# Altium project NC1-1BA.PrjPcb (part 1 of 2)
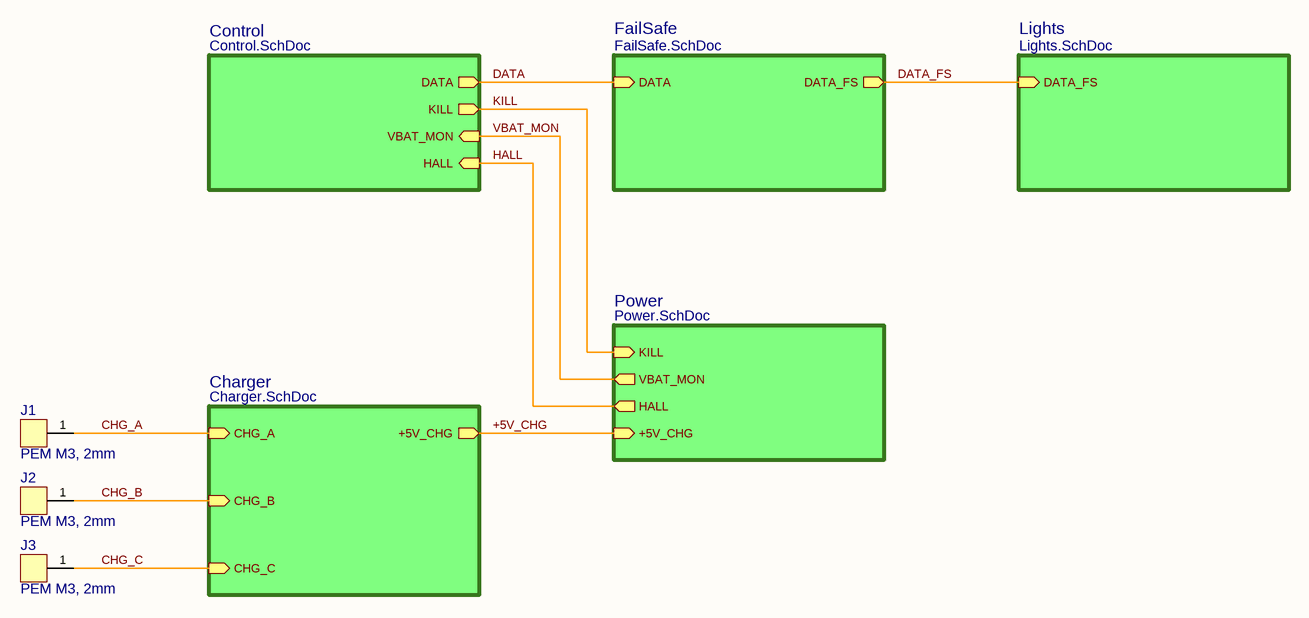
[diagram p0: NC1-1-Top.SchDoc]
Author: ahorat / daniw; Index_Main: B; Index_Sub: A; Layout_Designer: daniw; PCB_NAME: NC1-1; Project: NightCone; Schema_Designer: ahorat / daniw
7 sheets, 278 parts. Net scope: hierarchical (ports join the sheet entries above them; power ports are global).
Board files: NC1-1B-BASIS.PcbDoc, NC1-1B-PANEL_Single.PcbDoc
Sheets:
  NC1-1-Top.SchDoc
    Control = Control.SchDoc
    FailSafe = FailSafe.SchDoc
    Lights = Lights.SchDoc
      LED0 = LED.SchDoc
      LED1 = LED.SchDoc
      LED2 = LED.SchDoc
      LED3 = LED.SchDoc
      LED4 = LED.SchDoc
      LED5 = LED.SchDoc
      LED6 = LED.SchDoc
      LED7 = LED.SchDoc
      LED8 = LED.SchDoc
      LED9 = LED.SchDoc
      LED10 = LED.SchDoc
      LED11 = LED.SchDoc
      LED12 = LED.SchDoc
      LED13 = LED.SchDoc
      LED14 = LED.SchDoc
      LED15 = LED.SchDoc
      LED16 = LED.SchDoc
      LED17 = LED.SchDoc
      LED18 = LED.SchDoc
    Charger = Charger.SchDoc
    Power = Power.SchDoc

## Sheet NC1-1-Top.SchDoc: Top
size A3; SheetNumber: 1; SheetTotal: 7

### Parts
J1  PEM M3, 2mm  [MECH_SMTSO3020CTJ]
J2  PEM M3, 2mm  [MECH_SMTSO3020CTJ]
J3  PEM M3, 2mm  [MECH_SMTSO3020CTJ]

### Sub-sheets
Charger = Charger.SchDoc: +5V_CHG (out), CHG_A (in), CHG_B (in), CHG_C (in)
Control = Control.SchDoc: DATA (out), KILL (out), VBAT_MON (in), HALL (in)
FailSafe = FailSafe.SchDoc: DATA_FS (out), DATA (in)
Lights = Lights.SchDoc: DATA_FS (in)
Power = Power.SchDoc: KILL (in), +5V_CHG (in), VBAT_MON (out), HALL (out)

### Nets
+5V_CHG: sheet Charger/+5V_CHG, sheet Power/+5V_CHG
CHG_A: J1.1 ; sheet Charger/CHG_A
CHG_B: J2.1 ; sheet Charger/CHG_B
CHG_C: J3.1 ; sheet Charger/CHG_C
DATA: sheet Control/DATA, sheet FailSafe/DATA
DATA_FS: sheet FailSafe/DATA_FS, sheet Lights/DATA_FS
HALL: sheet Control/HALL, sheet Power/HALL
KILL: sheet Control/KILL, sheet Power/KILL
VBAT_MON: sheet Control/VBAT_MON, sheet Power/VBAT_MON

### Notes on the sheet
- Date:
- Size:
- A3
- Schema:
- Layout:

### Library data of the parts
J1-J3 = PEM M3, 2mm: Solder Nut M3x0.5, 2mm; Manufacturer: GENERIC; Part Number: PEM M3, 2mm; Manufacturer 2: PEM; Manufacturer Part Number 2: SMTSO-M3-2ET; Supplier 2: Mouser; Supplier Part Number 2: 153-SMTSO-M3-2ET; Manufacturer 3: Sinhoo; Manufacturer Part Number 3: SMTSO3020MTJ; Supplier 3: LCSC; Supplier Part Number 3: C2915633; JLC Type: Extended

## Sheet Control.SchDoc: Control Module
size A3; SheetNumber: 2; SheetTotal: 7
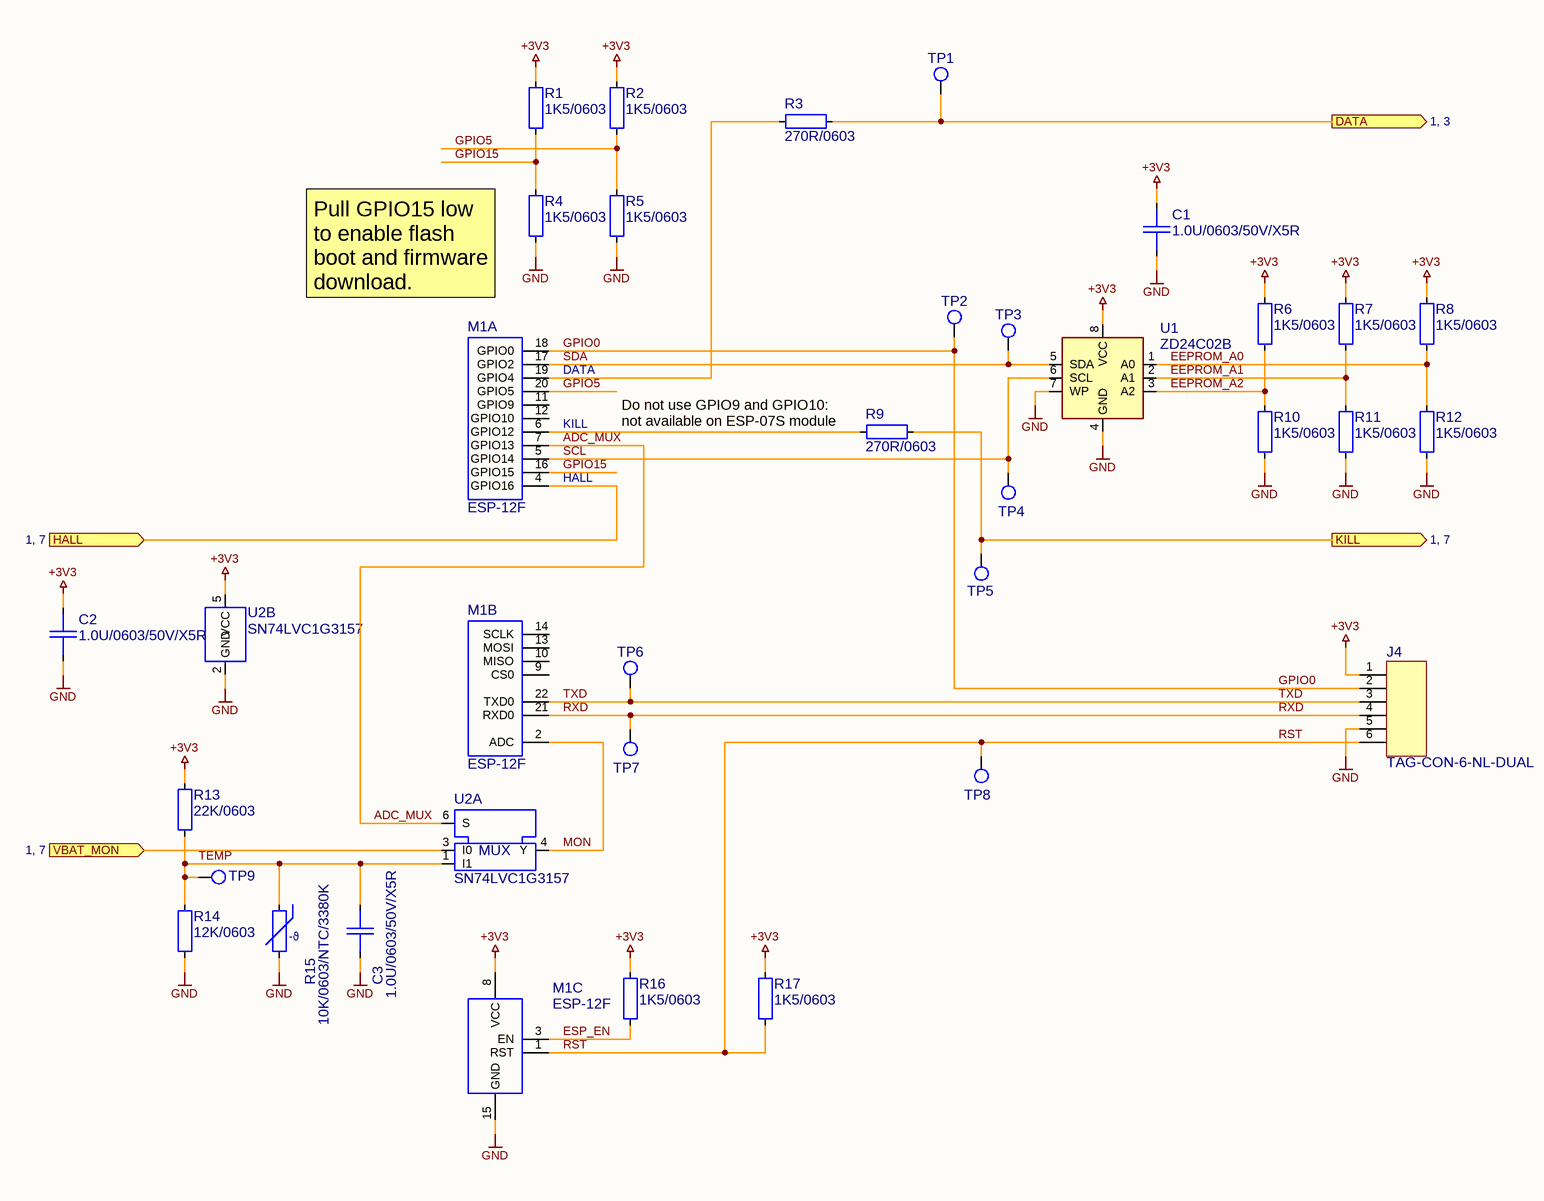
[diagram p1: Control.SchDoc]

### Parts
C1  1.0U/0603/50V/X5R  [CAP0603_X7R]
C2  1.0U/0603/50V/X5R  [CAP0603_X7R]
C3  1.0U/0603/50V/X5R  [CAP0603_X7R]
J4  TAG-CON-6-NL-DUAL  [TC2030-NL-2]
M1  ESP-12F  [ESP-12F]  (parts A,B,C of 3)
R1  1K5/0603  [R0603-0.40-WW]
R2  1K5/0603  [R0603-0.40-WW]
R3  270R/0603  [R0603-0.40-WW]
R4  1K5/0603  [R0603-0.40-WW]
R5  1K5/0603  [R0603-0.40-WW]
R6  1K5/0603  [R0603-0.40-WW]
R7  1K5/0603  [R0603-0.40-WW]
R8  1K5/0603  [R0603-0.40-WW]
R9  270R/0603  [R0603-0.40-WW]
R10  1K5/0603  [R0603-0.40-WW]
R11  1K5/0603  [R0603-0.40-WW]
R12  1K5/0603  [R0603-0.40-WW]
R13  22K/0603  [R0603-0.40-WW]
R14  12K/0603  [R0603-0.40-WW]
R15  10K/0603/NTC/3380K  [R0603-0.40-WW]
R16  1K5/0603  [R0603-0.40-WW]
R17  1K5/0603  [R0603-0.40-WW]
TP1  TP_THD_1.5/0.8  [TP_THD_1.5/0.8]  (value not drawn)  (no BOM)
TP2  TP_THD_1.5/0.8  [TP_THD_1.5/0.8]  (value not drawn)  (no BOM)
TP3  TP_THD_1.5/0.8  [TP_THD_1.5/0.8]  (value not drawn)  (no BOM)
TP4  TP_THD_1.5/0.8  [TP_THD_1.5/0.8]  (value not drawn)  (no BOM)
TP5  TP_THD_1.5/0.8  [TP_THD_1.5/0.8]  (value not drawn)  (no BOM)
TP6  TP_THD_1.5/0.8  [TP_THD_1.5/0.8]  (value not drawn)  (no BOM)
TP7  TP_THD_1.5/0.8  [TP_THD_1.5/0.8]  (value not drawn)  (no BOM)
TP8  TP_THD_1.5/0.8  [TP_THD_1.5/0.8]  (value not drawn)  (no BOM)
TP9  TP_THD_1.5/0.8  [TP_THD_1.5/0.8]  (value not drawn)  (no BOM)
U1  ZD24C02B  [SOP127P600X155-8-SW]
U2  SN74LVC1G3157  [SOT65P210X95-6-SE]  (parts A,B of 2)

### Ports
DATA (out, see 1, 3), HALL (in, see 1, 7), KILL (out, see 1, 7), VBAT_MON (in, see 1, 7)

### Nets
+3V3: C1.1 C2.1 J4.1 M1.8(VCC) R1.1 R2.1 R6.1 R7.1 R8.1 R13.1 R16.1 R17.1 U1.8(VCC) U2.5(VCC)
GND: C1.2 C2.2 C3.2 J4.5 M1.15(GND) R4.2 R5.2 R10.2 R11.2 R12.2 R14.2 R15.2 U1.4(GND) U1.7(WP) U2.2(GND)
ADC_MUX: M1.7(GPIO13) U2.6(S)
DATA: R3.2 TP1.1 ; port DATA
EEPROM_A0: R8.2 R12.1 U1.1(A0)
EEPROM_A1: R7.2 R11.1 U1.2(A1)
EEPROM_A2: R6.2 R10.1 U1.3(A2)
ESP_EN: M1.3(EN) R16.2
GPIO0: J4.2 M1.18(GPIO0) TP2.1
GPIO5: M1.20(GPIO5) R2.2 R5.1
GPIO15: M1.16(GPIO15) R1.2 R4.1
HALL: M1.4(GPIO16) ; port HALL
KILL: R9.2 TP5.1 ; port KILL
MON: M1.2(ADC) U2.4(Y)
RST: J4.6 M1.1(RST) R17.2 TP8.1
RXD: J4.4 M1.21(RXD0) TP7.1
SCL: M1.5(GPIO14) TP4.1 U1.6(SCL)
SDA: M1.17(GPIO2) TP3.1 U1.5(SDA)
TEMP: C3.1 R13.2 R14.1 R15.1 TP9.1 U2.1(I1)
TXD: J4.3 M1.22(TXD0) TP6.1
VBAT_MON: U2.3(I0) ; port VBAT_MON
NetM1_6: M1.6(GPIO12) R9.1
NetM1_19: M1.19(GPIO4) R3.1

Not connected (* = marked no-connect by the designer): M1 9(CS0) 10(MISO) 11(GPIO9) 12(GPIO10) 13(MOSI) 14(SCLK)

### Notes on the sheet
- Pull GPIO15 low to enable flash boot and firmware download.
- (near M1) DATA
- (near M1) KILL
- (near M1) HALL
- (near R9) Do not use GPIO9 and GPIO10:
  not available on ESP-07S module
- Date:
- Size:
- A3
- Schema:
- Layout:
- (in symbol 10K/0603/NTC/3380K) -ϑ
- (in symbol SN74LVC1G3157, part A) MUX

### Library data of the parts
C1-C3 = 1.0U/0603/50V/X5R: CAP SM 0603 1.0uF 50V X5R; Manufacturer: GENERIC; Manufacturer 1: Samsung Electro-Mechanics; Manufacturer Part Number 1: CL10A105KB8NNNC; Absolute Value: 1E-6; Eurocircuits GPN: GPC0603105-X5R; Part Number: 1.0U/0603/50V/X5R; Package: 0603; Value: 1.0uF; Manufacturer Part Number 3: CL10A105KB8NNNC; Supplier 3: LCSC; Supplier Part Number 3: C15849; JLC Type: Basic; HelpURL: https://mm.digikey.com/Volume0/opasdata/d220001/medias/docus/658/CL10A105KB8NNNC_Spec.pdf; Supplier 1: Digi-Key; Supplier Part Number 1: 1276-1860-1-ND
J4 = TAG-CON-6-NL-DUAL: Tag-Connect 2030-NL, 6 pins, no legs, two-sided; Part Number: TAG-CON-6-NL-DUAL; Manufacturer: TAG-CONNECT; HelpURL: https://www.tag-connect.com/wp-content/uploads/bsk-pdf-manager/2022/06/TC2030-MCP-NL.pdf
M1 = ESP-12F: ESP8266 based Module with 4MByte Storage; Manufacturer: AI-Thinker; Part Number: ESP-12F; Package: Board; Manufacturer 3: Ai-Thinker; Manufacturer Part Number 3: ESP-12F(ESP8266MOD); Supplier 3: LCSC; Supplier Part Number 3: C82891; JLC Type: Extended
R1 R2 R4-R8 R10-R12 R16 R17 = 1K5/0603: RES SM 0603 1K5; Manufacturer: GENERIC; Manufacturer 1: YAGEO; Manufacturer Part Number 1: RC0603FR-131K5L; Absolute Value: 1500; Part Number: 1K5/0603; Package: 0603; Value: 1K5; HelpURL: https://www.yageo.com/upload/media/product/app/datasheet/rchip/pyu-rc_group_51_rohs_l.pdf; Supplier 1: Digi-Key; Supplier Part Number 1: 13-RC0603FR-131K5LCT-ND; Manufacturer 2: YAGEO; Manufacturer Part Number 2: RC0603FR-101K5L; Supplier 2: Digi-Key; Supplier Part Number 2: 13-RC0603FR-101K5LCT-ND; Manufacturer 3: UNI-ROYAL(Uniroyal Elec); Manufacturer Part Number 3: 0603WAF1501T5E; Supplier 3: LCSC; Supplier Part Number 3: C22843; JLC Type: Basic
R3 R9 = 270R/0603: RES SM 0603 270R; Manufacturer: GENERIC; Manufacturer 1: YAGEO; Manufacturer Part Number 1: RC0603FR-13270RL; Absolute Value: 270; Eurocircuits GPN: GPR0603270R; Part Number: 270R/0603; Package: 0603; Value: 270R; HelpURL: https://www.yageo.com/upload/media/product/productsearch/datasheet/rchip/PYu-RC_Group_51_RoHS_L_12.pdf; Supplier 1: Digi-Key; Supplier Part Number 1: 13-RC0603FR-13270RLCT-ND; Manufacturer 2: YAGEO; Manufacturer Part Number 2: RC0603FR-10270RL; Supplier 2: Digi-Key; Supplier Part Number 2: 13-RC0603FR-10270RLCT-ND; Manufacturer 3: UNI-ROYAL(Uniroyal Elec); Manufacturer Part Number 3: 0603WAF2700T5E; Supplier 3: LCSC; Supplier Part Number 3: C22966; JLC Type: Basic
R13 = 22K/0603: RES SM 0603 22K; Manufacturer: GENERIC; Manufacturer 1: YAGEO; Manufacturer Part Number 1: RC0603FR-1322KL; Absolute Value: 22000; Eurocircuits GPN: GPR060322K; Part Number: 22K/0603; Package: 0603; Value: 22K; HelpURL: https://www.yageo.com/upload/media/product/app/datasheet/rchip/pyu-rc_group_51_rohs_l.pdf; Supplier 1: Digi-Key; Supplier Part Number 1: 13-RC0603FR-1322KLCT-ND; Manufacturer 2: YAGEO; Manufacturer Part Number 2: RC0603FR-1022KL; Supplier 2: Digi-Key; Supplier Part Number 2: 13-RC0603FR-1022KLCT-ND; Manufacturer 3: UNI-ROYAL(Uniroyal Elec); Manufacturer Part Number 3: 0603WAF2202T5E; Supplier 3: LCSC; Supplier Part Number 3: C31850; JLC Type: Basic
R14 = 12K/0603: RES SM 0603 12K; Manufacturer: GENERIC; Manufacturer 1: YAGEO; Manufacturer Part Number 1: RC0603FR-1312KL; Absolute Value: 12000; Eurocircuits GPN: GPR060312K; Part Number: 12K/0603; Package: 0603; Value: 12K; HelpURL: https://www.yageo.com/upload/media/product/app/datasheet/rchip/pyu-rc_group_51_rohs_l.pdf; Supplier 1: Digi-Key; Supplier Part Number 1: 13-RC0603FR-1312KLCT-ND; Manufacturer 2: YAGEO; Manufacturer Part Number 2: RC0603FR-1012KL; Supplier 2: Digi-Key; Supplier Part Number 2: 13-RC0603FR-1012KLCT-ND
R15 = 10K/0603/NTC/3380K: RES NTC SM 0603 10K; Manufacturer: GENERIC; Manufacturer 1: Murata; Manufacturer Part Number 1: NCU18XH103E60RB; Absolute Value: 10000; Part Number: 10K/0603/NTC/3380K; Package: 603; Value: 10K; HelpURL: https://www.murata.com/en-us/api/pdfdownloadapi?cate=luNTCforTempeSenso&partno=NCU18XH103E60RB; Supplier 1: Digi-Key; Supplier Part Number 1: 490-18164-1-ND; Manufacturer 3: Sunlord; Manufacturer Part Number 3: SDNT1608X103F3380FTF; Supplier 3: LCSC; Supplier Part Number 3: C316397; JLC Type: Extended
TP1-TP9 = TP_THD_1.5/0.8: THT Test Point 1.5/0.8mm; Manufacturer: NONE; Part Number: TP_THD_1.5/0.8
U1 = ZD24C02B: I2C-Compatible (2-wire) Serial EEPROM 2K bits; Manufacturer: Zetta; Part Number: ZD24C02B; Package: SOIC-8; HelpURL: https://datasheet.lcsc.com/lcsc/2402020955_Zetta-ZD24C02B-SSGMB_C5374786.pdf; Manufacturer 3: Zetta; Manufacturer Part Number 3: ZD24C02B-SSGMB; Supplier 3: LCSC; Supplier Part Number 3: C5374786; JLC Type: Extended
U2 = SN74LVC1G3157: Single-Pole-Double-Throw Analog Switch; Manufacturer: TI; Part Number: SN74LVC1G3157; Package: SOT-363-6; Manufacturer 3: Texas Instruments; Manufacturer Part Number 3: SN74LVC1G3157DCKR; Supplier 3: LCSC; Supplier Part Number 3: C38663

## Sheet FailSafe.SchDoc: FailSafe
size A3; SheetNumber: 3; SheetTotal: 7
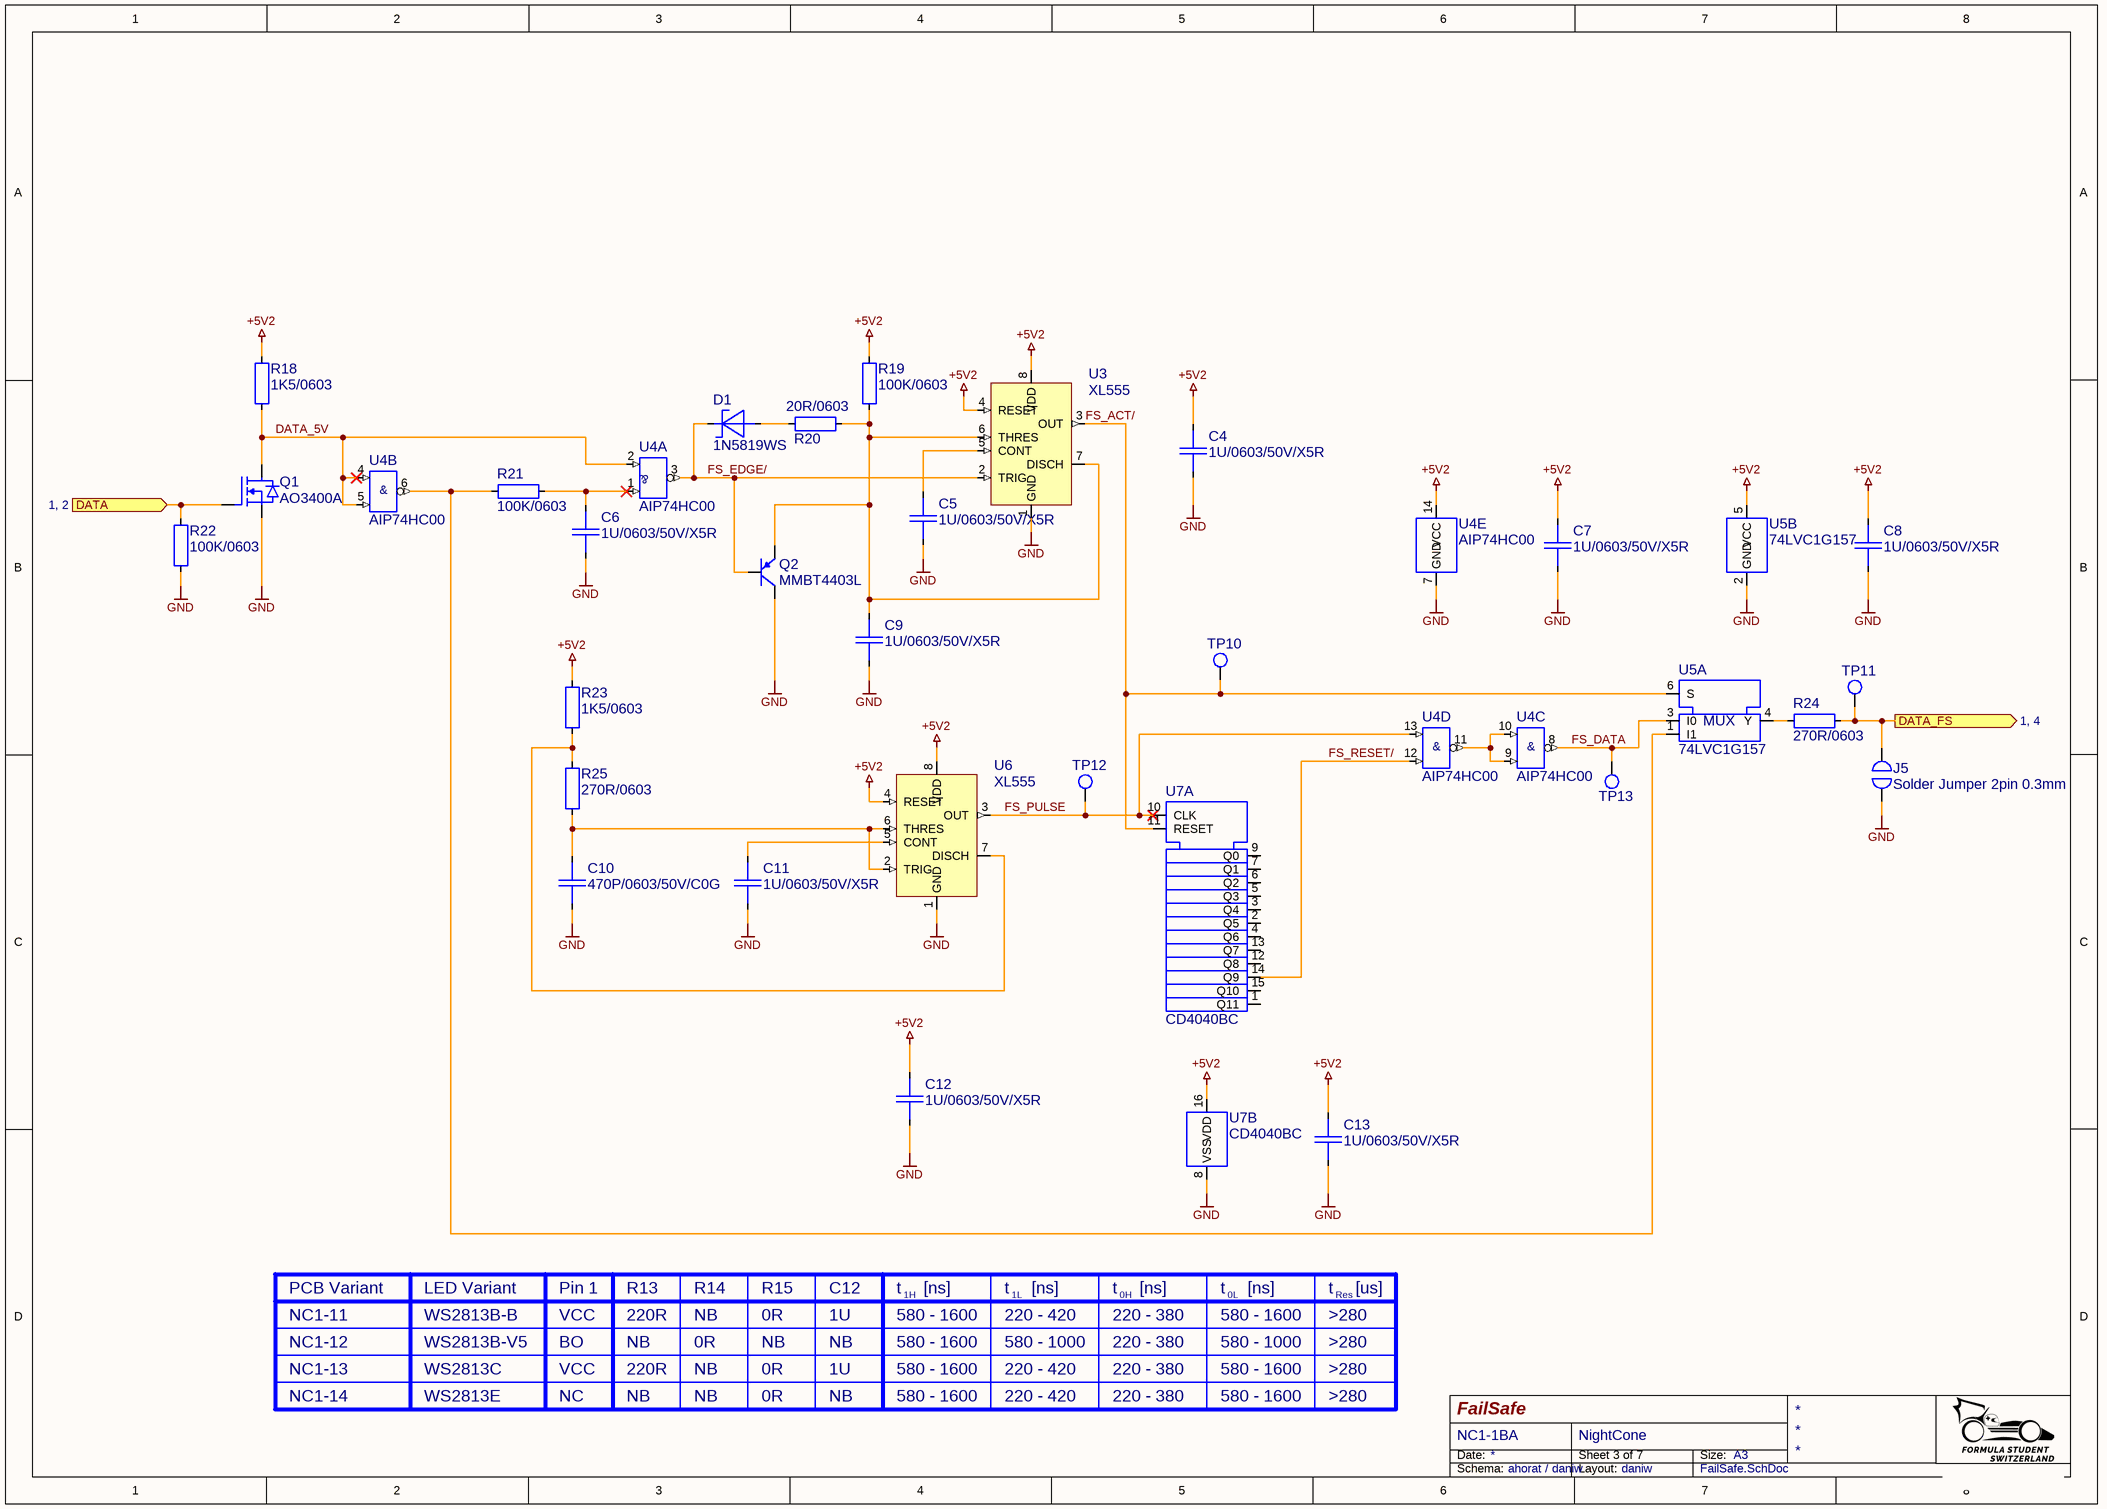
[diagram p2: FailSafe.SchDoc]

### Parts
C4  1U/0603/50V/X5R  [CAP0603_X7R]
C5  1U/0603/50V/X5R  [CAP0603_X7R]
C6  1U/0603/50V/X5R  [CAP0603_X7R]
C7  1U/0603/50V/X5R  [CAP0603_X7R]
C8  1U/0603/50V/X5R  [CAP0603_X7R]
C9  1U/0603/50V/X5R  [CAP0603_X7R]
C10  470P/0603/50V/C0G  [CAP0603_C0G]
C11  1U/0603/50V/X5R  [CAP0603_X7R]
C12  1U/0603/50V/X5R  [CAP0603_X7R]
C13  1U/0603/50V/X5R  [CAP0603_X7R]
D1  1N5819WS  [SOD2513X100]
J5  Solder Jumper 2pin 0.3mm  [Solder_Jumper_2pin_0.3mm]
Q1  AO3400A  [SOT2395P280X125-3-SE]
Q2  MMBT4403L  [SOT2395P280X125-3-SE]
R18  1K5/0603  [R0603-0.40-WW]
R19  100K/0603  [R0603-0.40-WW]
R20  20R/0603  [R0603-0.40-WW]
R21  100K/0603  [R0603-0.40-WW]
R22  100K/0603  [R0603-0.40-WW]
R23  1K5/0603  [R0603-0.40-WW]
R24  270R/0603  [R0603-0.40-WW]
R25  270R/0603  [R0603-0.40-WW]
TP10  TP_THD_1.5/0.8  [TP_THD_1.5/0.8]  (value not drawn)  (no BOM)
TP11  TP_THD_1.5/0.8  [TP_THD_1.5/0.8]  (value not drawn)  (no BOM)
TP12  TP_THD_1.5/0.8  [TP_THD_1.5/0.8]  (value not drawn)  (no BOM)
TP13  TP_THD_1.5/0.8  [TP_THD_1.5/0.8]  (value not drawn)  (no BOM)
U3  XL555  [SOP127P600X155-8-SW]
U4  AIP74HC00  [SOP127P600X155-14-SW]  (parts A,B,C,D,E of 5)
U5  74LVC1G157  [SOT65P210X95-6-SE]  (parts A,B of 2)
U6  XL555  [SOP127P600X155-8-SW]
U7  CD4040BC  [SOP127P600X155-16-SW]  (parts A,B of 2)

### Ports
DATA (in, see 1, 2), DATA_FS (out, see 1, 4)

### Nets
+5V2: C4.1 C7.1 C8.1 C12.1 C13.1 R18.1 R19.1 R23.1 U3.4(RESET) U3.8(VDD) U4.14(VCC) U5.5(VCC) U6.4(RESET) U6.8(VDD) U7.16(VDD)
GND: C4.2 C5.2 C6.2 C7.2 C8.2 C9.2 C10.2 C11.2 C12.2 C13.2 J5.2 Q1.2(SOURCE) Q2.3(COLLECTOR) R22.1 U3.1(GND) U4.7(GND) U5.2(GND) U6.1(GND) U7.8(VSS)
DATA: Q1.1(GATE) R22.2 ; port DATA
DATA_5V: Q1.3(DRAIN) R18.2 U4.2(B0) U4.4(A1) U4.5(B1)
DATA_FS: J5.1 R24.2 TP11.1 ; port DATA_FS
FS_ACT/: TP10.1 U3.3(OUT) U5.6(S) U7.11(RESET)
FS_DATA: TP13.1 U4.8(Y2) U5.3(I0)
FS_EDGE/: D1.1 Q2.1(BASE) U3.2(TRIG) U4.3(Y0)
FS_PULSE: TP12.1 U4.13(A3) U6.3(OUT) U7.10(CLK)
FS_RESET/: U4.12(B3) U7.14(Q9)
NetC5_1: C5.1 U3.5(CONT)
NetC6_1: C6.1 R21.2 U4.1(A0)
NetC9_1: C9.1 Q2.2(EMITTER) R19.2 R20.2 U3.6(THRES) U3.7(DISCH)
NetC10_1: C10.1 R25.2 U6.2(TRIG) U6.6(THRES)
NetC11_1: C11.1 U6.5(CONT)
NetD1_2: D1.2 R20.1
NetR21_1: R21.1 U4.6(Y1) U5.1(I1)
NetR23_2: R23.2 R25.1 U6.7(DISCH)
NetR24_1: R24.1 U5.4(Y)
NetU4_9: U4.9(B2) U4.10(A2) U4.11(Y3)

Not connected (* = marked no-connect by the designer): U7 1(Q11) 2(Q5) 3(Q4) 4(Q6) 5(Q3) 6(Q2) 7(Q1) 9(Q0) 12(Q8) 13(Q7) 15(Q10)

### Notes on the sheet
- PCB Variant
- NC1-11
- LED Variant
- WS2813B-B
- Pin 1
- VCC
- R13
- 220R
- R14
- NB
- R15
- 0R
- C12
- 1U
- t
- 580 - 1600
- 1H
- [ns]
- 220 - 420
- 1L
- 220 - 380
- 0H
- 0L
- >280
- Res
- [us]
- NC1-12
- NC1-13
- NC1-14
- WS2813B-V5
- WS2813C
- WS2813E
- BO
- NC
- 580 - 1000
- Date:
- Size:
- A3
- Schema:
- Layout:
- (in symbol 74LVC1G157, part A) MUX
- (in symbol AIP74HC00, part A) &
- (in symbol AIP74HC00, part B) &
- (in symbol AIP74HC00, part C) &
- (in symbol AIP74HC00, part D) &

### Library data of the parts
C4-C9 C11-C13 = 1U/0603/50V/X5R: CAP SM 0603 1.0uF 50V X5R; Manufacturer: GENERIC; Absolute Value: 1E-6; Part Number: 1U/0603/50V/X5R; Package: 603; Value: 1.0uF; Manufacturer Part Number 3: CL10A105KB8NNNC; Supplier 3: LCSC; Supplier Part Number 3: C15849; JLC Type: Basic
C10 = 470P/0603/50V/C0G: CAP SM 0603 470pF 50V C0G; Manufacturer: GENERIC; Manufacturer 1: YAGEO; Manufacturer Part Number 1: CC0603JRNPO9BN471; Absolute Value: 4.7E-10; Part Number: 470P/0603/50V/C0G; Package: 603; Value: 470pF; HelpURL: https://www.yageo.com/upload/media/product/productsearch/datasheet/mlcc/UPY-GP_NP0_16V-to-50V_18.pdf; Supplier 1: Digi-Key; Supplier Part Number 1: 311-1520-1-ND; Manufacturer 2: YAGEO; Manufacturer Part Number 2: CC0603KRNPO9BN471; Supplier 2: Digi-Key; Supplier Part Number 2: 311-4038-1-ND; Manufacturer Part Number 3: GCM1885C1H471JA16D; Supplier 3: LCSC; Supplier Part Number 3: C126566; JLC Type: Extended
D1 = 1N5819WS: 40V 600mV@1A 1A SOD-323 Schottky Barrier Diodes (SBD) ROHS; Manufacturer: GENERIC; Part Number: 1N5819WS; Package: SOD323; Value: 1N5819WS; Absolute Value: 40V; HelpURL: https://datasheet.lcsc.com/lcsc/2204281430_Guangdong-Hottech-1N5819WS_C191023.pdf; Manufacturer 3: Guangdong Hottech; Manufacturer Part Number 3: 1N5819WS; Supplier 3: LCSC; Supplier Part Number 3: C191023; JLC Type: Basic
J5 = Solder_Jumper_2pin_0.3mm: Solder jumper with two pins with a spacing of 0.3mm; Manufacturer: NONE; Part Number: Solder_Jumper_2pin_0.3mm
Q1 = AO3400A: 30V N-Channel MOSFET; Manufacturer: Alpha & Omega Semiconductor; Part Number: AO3400A; Package: SOT23; HelpURL: https://aosmd.com/res/data_sheets/AO3400A.pdf; Manufacturer 3: Alpha & Omega Semiconductor; Manufacturer Part Number 3: AO3400A; Supplier 3: LCSC; Supplier Part Number 3: C20917; JLC Type: Basic
Q2 = MMBT4403L: Switching Transistor PNP Silicon; Manufacturer: ON SEMI; Part Number: MMBT4403L; Package: SOT23; HelpURL: https://www.onsemi.com/pdf/datasheet/mmbt4403lt1-d.pdf; Manufacturer 3: ONSEMI; Manufacturer Part Number 3: MMBT4403LT1G; Supplier 3: LCSC; Supplier Part Number 3: C78864; JLC Type: Extended
R18 R23 = 1K5/0603: as R1 on sheet Control; Part Number: 1K5/0603; Package: 0603; Value: 1K5; HelpURL: https://www.yageo.com/upload/media/product/app/datasheet/rchip/pyu-rc_group_51_rohs_l.pdf; Supplier 1: Digi-Key; Supplier Part Number 1: 13-RC0603FR-131K5LCT-ND; Manufacturer 2: YAGEO; Manufacturer Part Number 2: RC0603FR-101K5L; Supplier 2: Digi-Key; Supplier Part Number 2: 13-RC0603FR-101K5LCT-ND; Manufacturer 3: UNI-ROYAL(Uniroyal Elec); Manufacturer Part Number 3: 0603WAF1501T5E; Supplier 3: LCSC; Supplier Part Number 3: C22843; JLC Type: Basic
R19 R21 R22 = 100K/0603: RES SM 0603 100K; Manufacturer: GENERIC; Manufacturer 1: YAGEO; Manufacturer Part Number 1: RC0603FR-13100KL; Absolute Value: 100000; Part Number: 100K/0603; Package: 0603; Value: 100K; HelpURL: https://www.yageo.com/upload/media/product/productsearch/datasheet/rchip/PYu-RC_Group_51_RoHS_L_12.pdf; Supplier 1: Digi-Key; Supplier Part Number 1: 13-RC0603FR-13100KLCT-ND; Manufacturer 2: YAGEO; Manufacturer Part Number 2: RC0603FR-10100KL; Supplier 2: Digi-Key; Supplier Part Number 2: 13-RC0603FR-10100KLCT-ND; Manufacturer 3: UNI-ROYAL(Uniroyal Elec); Manufacturer Part Number 3: 0603WAF1003T5E; Supplier 3: LCSC; Supplier Part Number 3: C25803; JLC Type: Basic
R20 = 20R/0603: RES SM 0603 20R; Manufacturer: GENERIC; Manufacturer 1: YAGEO; Manufacturer Part Number 1: RC0603FR-1320RL; Absolute Value: 20; Part Number: 20R/0603; Package: 0603; Value: 20R; HelpURL: https://www.yageo.com/upload/media/product/app/datasheet/rchip/pyu-rc_group_51_rohs_l.pdf; Supplier 1: Digi-Key; Supplier Part Number 1: 13-RC0603FR-1320RLCT-ND; Manufacturer 2: YAGEO; Manufacturer Part Number 2: RC0603FR-1020RL; Supplier 2: Digi-Key; Supplier Part Number 2: 13-RC0603FR-1020RLCT-ND; Manufacturer 3: UNI-ROYAL(Uniroyal Elec); Manufacturer Part Number 3: 0603WAF200JT5E; Supplier 3: LCSC; Supplier Part Number 3: C22950; JLC Type: Basic
R24 R25 = 270R/0603: RES SM 0603 270R; Manufacturer: GENERIC; Manufacturer 1: YAGEO; Manufacturer Part Number 1: RC0603FR-13270RL; Absolute Value: 270; Part Number: 270R/0603; Package: 0603; Value: 270R; HelpURL: https://www.yageo.com/upload/media/product/productsearch/datasheet/rchip/PYu-RC_Group_51_RoHS_L_12.pdf; Supplier 1: Digi-Key; Supplier Part Number 1: 13-RC0603FR-13270RLCT-ND; Manufacturer 2: YAGEO; Manufacturer Part Number 2: RC0603FR-10270RL; Supplier 2: Digi-Key; Supplier Part Number 2: 13-RC0603FR-10270RLCT-ND; Manufacturer 3: UNI-ROYAL(Uniroyal Elec); Manufacturer Part Number 3: 0603WAF2700T5E; Supplier 3: LCSC; Supplier Part Number 3: C22966; JLC Type: Basic
TP10-TP13 = TP_THD_1.5/0.8: as TP1 on sheet Control; Part Number: TP_THD_1.5/0.8
U3 U6 = XL555: SOP-8 Timers / Clock Oscillators ROHS; Manufacturer: XINLUDA; Part Number: XL555; Package: SOP8; HelpURL: https://datasheet.lcsc.com/lcsc/2212101330_XINLUDA-XL555_C521186.pdf; Manufacturer 3: XINLUDA; Manufacturer Part Number 3: XL555; Supplier 3: LCSC; Supplier Part Number 3: C521186; JLC Type: Extended
U4 = AIP74HC00: Quad 2-input NAND; Manufacturer: Wuxi I-core Elec; Part Number: AIP74HC00; Package: SOP-14; Manufacturer 3: Wuxi I-core Elec; Manufacturer Part Number 3: AIP74HC00SA.TB; Supplier 3: LCSC; Supplier Part Number 3: C2943283; JLC Type: Extended
U5 = 74LVC1G157: Single 2-input multiplexer; Manufacturer: Nexperia; Part Number: 74LVC1G157; Package: SOT-363-6; Manufacturer 3: Nexperia; Manufacturer Part Number 3: 74LVC1G157GW,125; Supplier 3: LCSC; Supplier Part Number 3: C135822; JLC Type: Extended
U7 = CD4040BC: 12-Stage binary ripple Counter; Manufacturer: HGSEMI; Part Number: CD4040BC; Package: SOP-16; Manufacturer 3: HGSEMI; Manufacturer Part Number 3: CD4040BM/TR; Supplier 3: LCSC; Supplier Part Number 3: C725347; JLC Type: Extended

## Sheet Lights.SchDoc: LEDs
size A3; SheetNumber: 4; SheetTotal: 7
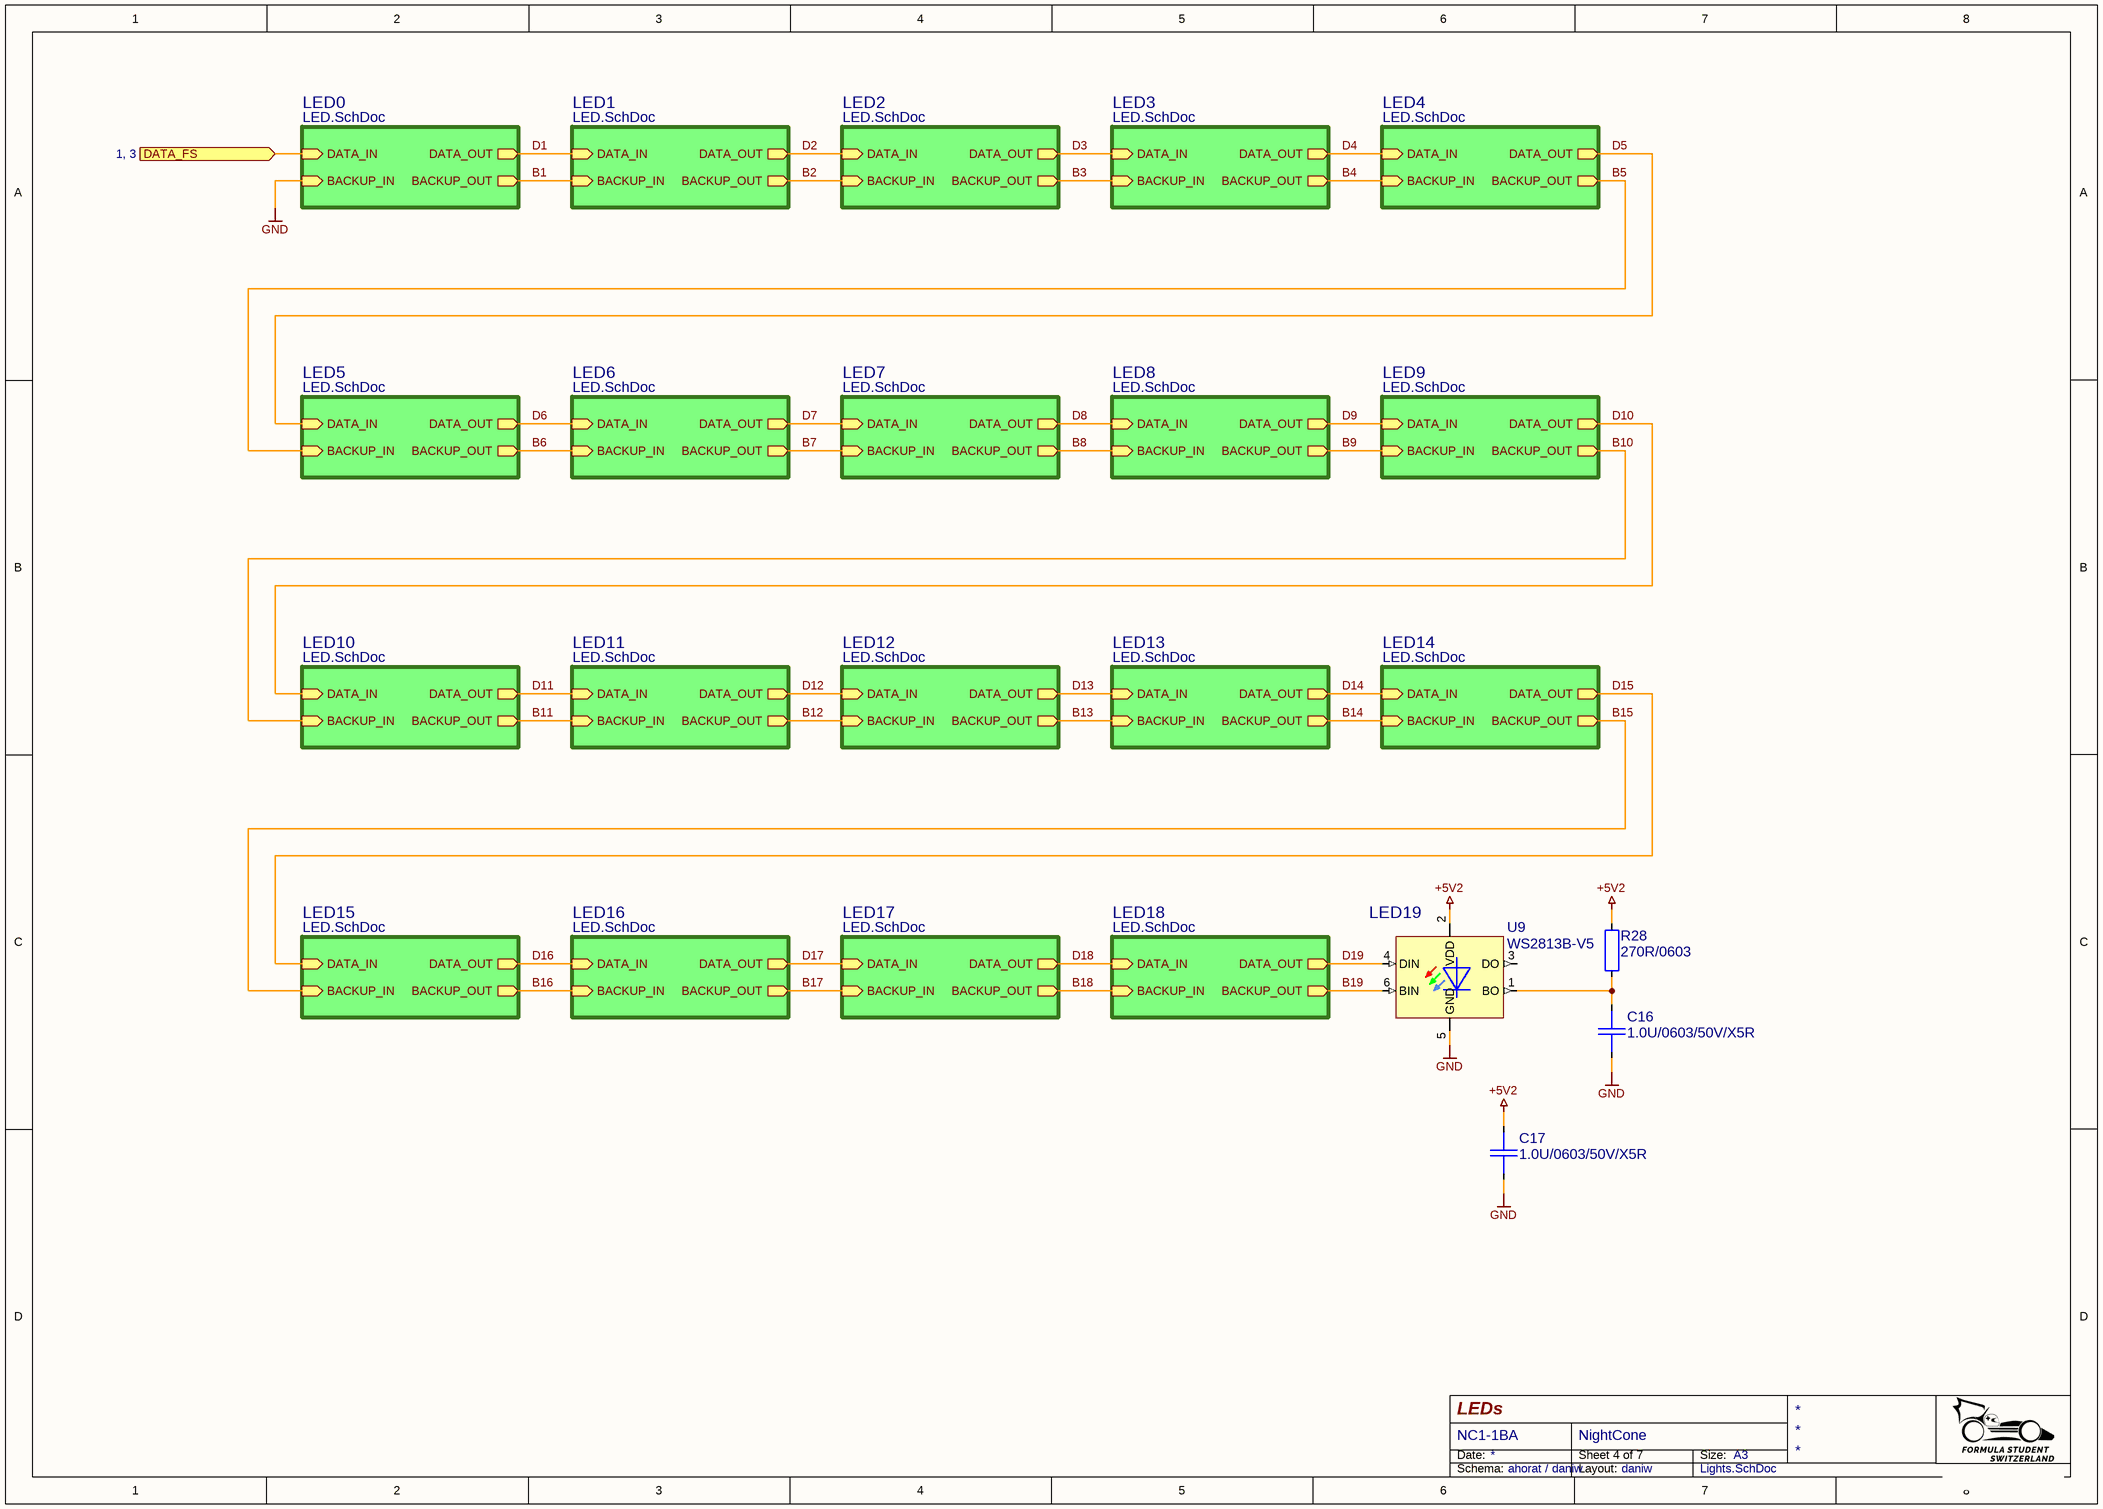
[diagram p3: Lights.SchDoc]

### Parts
C16  1.0U/0603/50V/X5R  [CAP0603_X7R]
C17  1.0U/0603/50V/X5R  [CAP0603_X7R]
R28  270R/0603  [R0603-0.40-WW]
U9  WS2813B-V5  [LEDM5050X165-6-SE]

### Sub-sheets
LED0 = LED.SchDoc: DATA_IN (in), BACKUP_IN (in), DATA_OUT (out), BACKUP_OUT (out)
LED1 = LED.SchDoc: DATA_IN (in), BACKUP_IN (in), DATA_OUT (out), BACKUP_OUT (out)
LED2 = LED.SchDoc: DATA_IN (in), BACKUP_IN (in), DATA_OUT (out), BACKUP_OUT (out)
LED3 = LED.SchDoc: DATA_IN (in), BACKUP_IN (in), DATA_OUT (out), BACKUP_OUT (out)
LED4 = LED.SchDoc: DATA_IN (in), BACKUP_IN (in), DATA_OUT (out), BACKUP_OUT (out)
LED5 = LED.SchDoc: DATA_IN (in), BACKUP_IN (in), DATA_OUT (out), BACKUP_OUT (out)
LED6 = LED.SchDoc: DATA_IN (in), BACKUP_IN (in), DATA_OUT (out), BACKUP_OUT (out)
LED7 = LED.SchDoc: DATA_IN (in), BACKUP_IN (in), DATA_OUT (out), BACKUP_OUT (out)
LED8 = LED.SchDoc: DATA_IN (in), BACKUP_IN (in), DATA_OUT (out), BACKUP_OUT (out)
LED9 = LED.SchDoc: DATA_IN (in), BACKUP_IN (in), DATA_OUT (out), BACKUP_OUT (out)
LED10 = LED.SchDoc: DATA_IN (in), BACKUP_IN (in), DATA_OUT (out), BACKUP_OUT (out)
LED11 = LED.SchDoc: DATA_IN (in), BACKUP_IN (in), DATA_OUT (out), BACKUP_OUT (out)
LED12 = LED.SchDoc: DATA_IN (in), BACKUP_IN (in), DATA_OUT (out), BACKUP_OUT (out)
LED13 = LED.SchDoc: DATA_IN (in), BACKUP_IN (in), DATA_OUT (out), BACKUP_OUT (out)
LED14 = LED.SchDoc: DATA_IN (in), BACKUP_IN (in), DATA_OUT (out), BACKUP_OUT (out)
LED15 = LED.SchDoc: DATA_IN (in), BACKUP_IN (in), DATA_OUT (out), BACKUP_OUT (out)
LED16 = LED.SchDoc: DATA_IN (in), BACKUP_IN (in), DATA_OUT (out), BACKUP_OUT (out)
LED17 = LED.SchDoc: DATA_IN (in), BACKUP_IN (in), DATA_OUT (out), BACKUP_OUT (out)
LED18 = LED.SchDoc: DATA_IN (in), BACKUP_IN (in), DATA_OUT (out), BACKUP_OUT (out)

### Ports
DATA_FS (in, see 1, 3)

### Nets
+5V2: C17.1 R28.1 U9.2(VDD)
GND: C16.2 C17.2 U9.5(GND) ; sheet LED0/BACKUP_IN
B1: sheet LED0/BACKUP_OUT, sheet LED1/BACKUP_IN
B2: sheet LED1/BACKUP_OUT, sheet LED2/BACKUP_IN
B3: sheet LED2/BACKUP_OUT, sheet LED3/BACKUP_IN
B4: sheet LED3/BACKUP_OUT, sheet LED4/BACKUP_IN
B5: sheet LED4/BACKUP_OUT, sheet LED5/BACKUP_IN
B6: sheet LED5/BACKUP_OUT, sheet LED6/BACKUP_IN
B7: sheet LED6/BACKUP_OUT, sheet LED7/BACKUP_IN
B8: sheet LED7/BACKUP_OUT, sheet LED8/BACKUP_IN
B9: sheet LED8/BACKUP_OUT, sheet LED9/BACKUP_IN
B10: sheet LED9/BACKUP_OUT, sheet LED10/BACKUP_IN
B11: sheet LED10/BACKUP_OUT, sheet LED11/BACKUP_IN
B12: sheet LED11/BACKUP_OUT, sheet LED12/BACKUP_IN
B13: sheet LED12/BACKUP_OUT, sheet LED13/BACKUP_IN
B14: sheet LED13/BACKUP_OUT, sheet LED14/BACKUP_IN
B15: sheet LED14/BACKUP_OUT, sheet LED15/BACKUP_IN
B16: sheet LED15/BACKUP_OUT, sheet LED16/BACKUP_IN
B17: sheet LED16/BACKUP_OUT, sheet LED17/BACKUP_IN
B18: sheet LED17/BACKUP_OUT, sheet LED18/BACKUP_IN
B19: U9.6(BIN) ; sheet LED18/BACKUP_OUT
D1: sheet LED0/DATA_OUT, sheet LED1/DATA_IN
D2: sheet LED1/DATA_OUT, sheet LED2/DATA_IN
D3: sheet LED2/DATA_OUT, sheet LED3/DATA_IN
D4: sheet LED3/DATA_OUT, sheet LED4/DATA_IN
D5: sheet LED4/DATA_OUT, sheet LED5/DATA_IN
D6: sheet LED5/DATA_OUT, sheet LED6/DATA_IN
D7: sheet LED6/DATA_OUT, sheet LED7/DATA_IN
D8: sheet LED7/DATA_OUT, sheet LED8/DATA_IN
D9: sheet LED8/DATA_OUT, sheet LED9/DATA_IN
D10: sheet LED9/DATA_OUT, sheet LED10/DATA_IN
D11: sheet LED10/DATA_OUT, sheet LED11/DATA_IN
D12: sheet LED11/DATA_OUT, sheet LED12/DATA_IN
D13: sheet LED12/DATA_OUT, sheet LED13/DATA_IN
D14: sheet LED13/DATA_OUT, sheet LED14/DATA_IN
D15: sheet LED14/DATA_OUT, sheet LED15/DATA_IN
D16: sheet LED15/DATA_OUT, sheet LED16/DATA_IN
D17: sheet LED16/DATA_OUT, sheet LED17/DATA_IN
D18: sheet LED17/DATA_OUT, sheet LED18/DATA_IN
D19: U9.4(DIN) ; sheet LED18/DATA_OUT
DATA_FS: port DATA_FS, sheet LED0/DATA_IN
NetC16_1: C16.1 R28.2 U9.1(BO)

Not connected (* = marked no-connect by the designer): U9 3(DO)

### Notes on the sheet
- (near U9) LED19
- Date:
- Size:
- A3
- Schema:
- Layout:

### Library data of the parts
C16 C17 = 1.0U/0603/50V/X5R: as C1 on sheet Control; Part Number: 1.0U/0603/50V/X5R; Package: 0603; Value: 1.0uF; HelpURL: https://mm.digikey.com/Volume0/opasdata/d220001/medias/docus/658/CL10A105KB8NNNC_Spec.pdf; Supplier 1: Digi-Key; Supplier Part Number 1: 1276-1860-1-ND; Manufacturer Part Number 3: CL10A105KB8NNNC; Supplier 3: LCSC; Supplier Part Number 3: C15849; JLC Type: Basic
R28 = 270R/0603: as R24 on sheet FailSafe; Part Number: 270R/0603; Package: 0603; Value: 270R; HelpURL: https://www.yageo.com/upload/media/product/productsearch/datasheet/rchip/PYu-RC_Group_51_RoHS_L_12.pdf; Supplier 1: Digi-Key; Supplier Part Number 1: 13-RC0603FR-13270RLCT-ND; Manufacturer 2: YAGEO; Manufacturer Part Number 2: RC0603FR-10270RL; Supplier 2: Digi-Key; Supplier Part Number 2: 13-RC0603FR-10270RLCT-ND; Manufacturer 3: UNI-ROYAL(Uniroyal Elec); Manufacturer Part Number 3: 0603WAF2700T5E; Supplier 3: LCSC; Supplier Part Number 3: C22966; JLC Type: Basic
U9 = WS2813B-V5: Intelligent control LED integrated light source with backup Pin; Manufacturer: WorldSemi; Part Number: WS2813B-V5; Package: SMD5050; HelpURL: https://datasheet.lcsc.com/lcsc/2012110135_Worldsemi-WS2813B-V5_C965558.pdf; Manufacturer 3: WorldSemi; Manufacturer Part Number 3: WS2813B-V5; Supplier 3: LCSC; Supplier Part Number 3: C965558; JLC Type: Extended

## Sheet LED.SchDoc: LEDs
size A3; SheetNumber: 5; SheetTotal: 7
Used 19 times, as channels Lights/LED0, Lights/LED1, Lights/LED2, Lights/LED3, Lights/LED4, Lights/LED5, Lights/LED6, Lights/LED7, Lights/LED8, Lights/LED9, Lights/LED10, Lights/LED11, Lights/LED12, Lights/LED13, Lights/LED14, Lights/LED15, Lights/LED16, Lights/LED17, Lights/LED18. Parts and nets are listed once, with the designators drawn on the sheet.
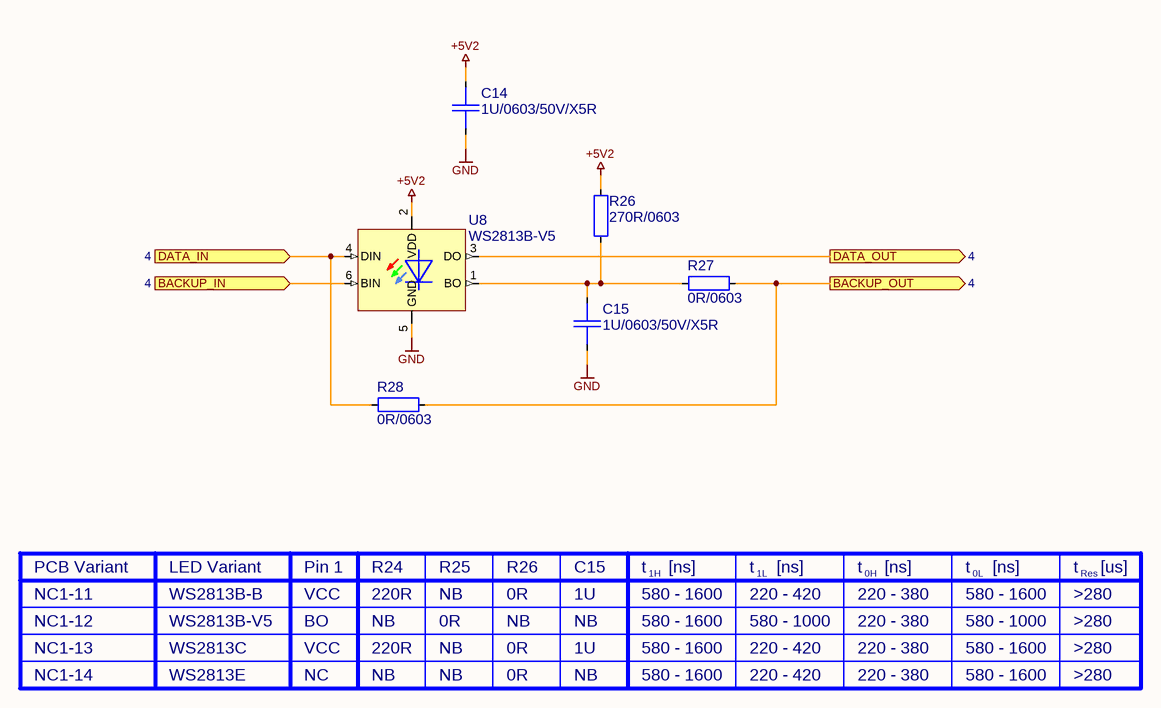
[diagram p4: LED.SchDoc]

### Parts
C14  1U/0603/50V/X5R  [CAP0603_X7R]
C15  1U/0603/50V/X5R  [CAP0603_X7R]
R26  270R/0603  [R0603-0.40-WW]
R27  0R/0603  [R0603-0.40-WW]
R28  0R/0603  [R0603-0.40-WW]
U8  WS2813B-V5  [LEDM5050X165-6-SE]

### Ports
BACKUP_IN (in, see 4), BACKUP_OUT (out, see 4), DATA_IN (in, see 4), DATA_OUT (out, see 4)

### Nets
+5V2: C14.1 R26.1 U8.2(VDD)
GND: C14.2 C15.2 U8.5(GND)
BACKUP_IN: U8.6(BIN) ; port BACKUP_IN
BACKUP_OUT: R27.2 R28.2 ; port BACKUP_OUT
DATA_IN: R28.1 U8.4(DIN) ; port DATA_IN
DATA_OUT: U8.3(DO) ; port DATA_OUT
NetC15_1: C15.1 R26.2 R27.1 U8.1(BO)

### Channels
Lights/LED0: designators end in _LED0; ports BACKUP_IN=GND BACKUP_OUT=B1 DATA_IN=DATA_FS DATA_OUT=D1
Lights/LED1: designators end in _LED1; ports BACKUP_IN=B1 BACKUP_OUT=B2 DATA_IN=D1 DATA_OUT=D2
Lights/LED2: designators end in _LED2; ports BACKUP_IN=B2 BACKUP_OUT=B3 DATA_IN=D2 DATA_OUT=D3
Lights/LED3: designators end in _LED3; ports BACKUP_IN=B3 BACKUP_OUT=B4 DATA_IN=D3 DATA_OUT=D4
Lights/LED4: designators end in _LED4; ports BACKUP_IN=B4 BACKUP_OUT=B5 DATA_IN=D4 DATA_OUT=D5
Lights/LED5: designators end in _LED5; ports BACKUP_IN=B5 BACKUP_OUT=B6 DATA_IN=D5 DATA_OUT=D6
Lights/LED6: designators end in _LED6; ports BACKUP_IN=B6 BACKUP_OUT=B7 DATA_IN=D6 DATA_OUT=D7
Lights/LED7: designators end in _LED7; ports BACKUP_IN=B7 BACKUP_OUT=B8 DATA_IN=D7 DATA_OUT=D8
Lights/LED8: designators end in _LED8; ports BACKUP_IN=B8 BACKUP_OUT=B9 DATA_IN=D8 DATA_OUT=D9
Lights/LED9: designators end in _LED9; ports BACKUP_IN=B9 BACKUP_OUT=B10 DATA_IN=D9 DATA_OUT=D10
Lights/LED10: designators end in _LED10; ports BACKUP_IN=B10 BACKUP_OUT=B11 DATA_IN=D10 DATA_OUT=D11
Lights/LED11: designators end in _LED11; ports BACKUP_IN=B11 BACKUP_OUT=B12 DATA_IN=D11 DATA_OUT=D12
Lights/LED12: designators end in _LED12; ports BACKUP_IN=B12 BACKUP_OUT=B13 DATA_IN=D12 DATA_OUT=D13
Lights/LED13: designators end in _LED13; ports BACKUP_IN=B13 BACKUP_OUT=B14 DATA_IN=D13 DATA_OUT=D14
Lights/LED14: designators end in _LED14; ports BACKUP_IN=B14 BACKUP_OUT=B15 DATA_IN=D14 DATA_OUT=D15
Lights/LED15: designators end in _LED15; ports BACKUP_IN=B15 BACKUP_OUT=B16 DATA_IN=D15 DATA_OUT=D16
Lights/LED16: designators end in _LED16; ports BACKUP_IN=B16 BACKUP_OUT=B17 DATA_IN=D16 DATA_OUT=D17
Lights/LED17: designators end in _LED17; ports BACKUP_IN=B17 BACKUP_OUT=B18 DATA_IN=D17 DATA_OUT=D18
Lights/LED18: designators end in _LED18; ports BACKUP_IN=B18 BACKUP_OUT=B19 DATA_IN=D18 DATA_OUT=D19

### Notes on the sheet
- PCB Variant
- LED Variant
- Pin 1
- R24
- R25
- R26
- C15
- t
- 1H
- [ns]
- 1L
- 0H
- 0L
- Res
- [us]
- NC1-12
- NC1-11
- NC1-13
- WS2813B-V5
- WS2813B-B
- WS2813C
- VCC
- BO
- 220R
- NB
- 0R
- 1U
- 580 - 1600
- 220 - 420
- 580 - 1000
- 220 - 380
- >280
- NC1-14
- WS2813E
- NC
- Date:
- Size:
- A3
- Schema:
- Layout:

### Library data of the parts
C14 C15 = 1U/0603/50V/X5R: as C4 on sheet FailSafe; Part Number: 1U/0603/50V/X5R; Package: 603; Value: 1.0uF; Manufacturer Part Number 3: CL10A105KB8NNNC; Supplier 3: LCSC; Supplier Part Number 3: C15849; JLC Type: Basic
R26 = 270R/0603: as R24 on sheet FailSafe; Part Number: 270R/0603; Package: 0603; Value: 270R; HelpURL: https://www.yageo.com/upload/media/product/productsearch/datasheet/rchip/PYu-RC_Group_51_RoHS_L_12.pdf; Supplier 1: Digi-Key; Supplier Part Number 1: 13-RC0603FR-13270RLCT-ND; Manufacturer 2: YAGEO; Manufacturer Part Number 2: RC0603FR-10270RL; Supplier 2: Digi-Key; Supplier Part Number 2: 13-RC0603FR-10270RLCT-ND; Manufacturer 3: UNI-ROYAL(Uniroyal Elec); Manufacturer Part Number 3: 0603WAF2700T5E; Supplier 3: LCSC; Supplier Part Number 3: C22966; JLC Type: Basic
R27 R28 = 0R/0603: RES SM 0603 0R; Manufacturer: GENERIC; Manufacturer 1: YAGEO; Manufacturer Part Number 1: RC0603FR-070RL; Absolute Value: 0; Part Number: 0R/0603; Package: 0603; Value: 0R; HelpURL: https://www.yageo.com/upload/media/product/app/datasheet/rchip/pyu-rc_group_51_rohs_l.pdf; Supplier 1: Digi-Key; Supplier Part Number 1: 311-0.0HRCT-ND; Manufacturer 2: YAGEO; Manufacturer Part Number 2: RC0603FR-130RL; Supplier 2: Digi-Key; Supplier Part Number 2: 13-RC0603FR-130RLCT-ND; Manufacturer 3: UNI-ROYAL(Uniroyal Elec); Manufacturer Part Number 3: 0603WAF0000T5E; Supplier 3: LCSC; Supplier Part Number 3: C21189; JLC Type: Basic
U8 = WS2813B-V5: as U9 on sheet Lights; Part Number: WS2813B-V5; Package: SMD5050; HelpURL: https://datasheet.lcsc.com/lcsc/2012110135_Worldsemi-WS2813B-V5_C965558.pdf; Manufacturer 3: WorldSemi; Manufacturer Part Number 3: WS2813B-V5; Supplier 3: LCSC; Supplier Part Number 3: C965558; JLC Type: Extended

## Sheet Charger.SchDoc: Charger
size A3; SheetNumber: 6; SheetTotal: 7
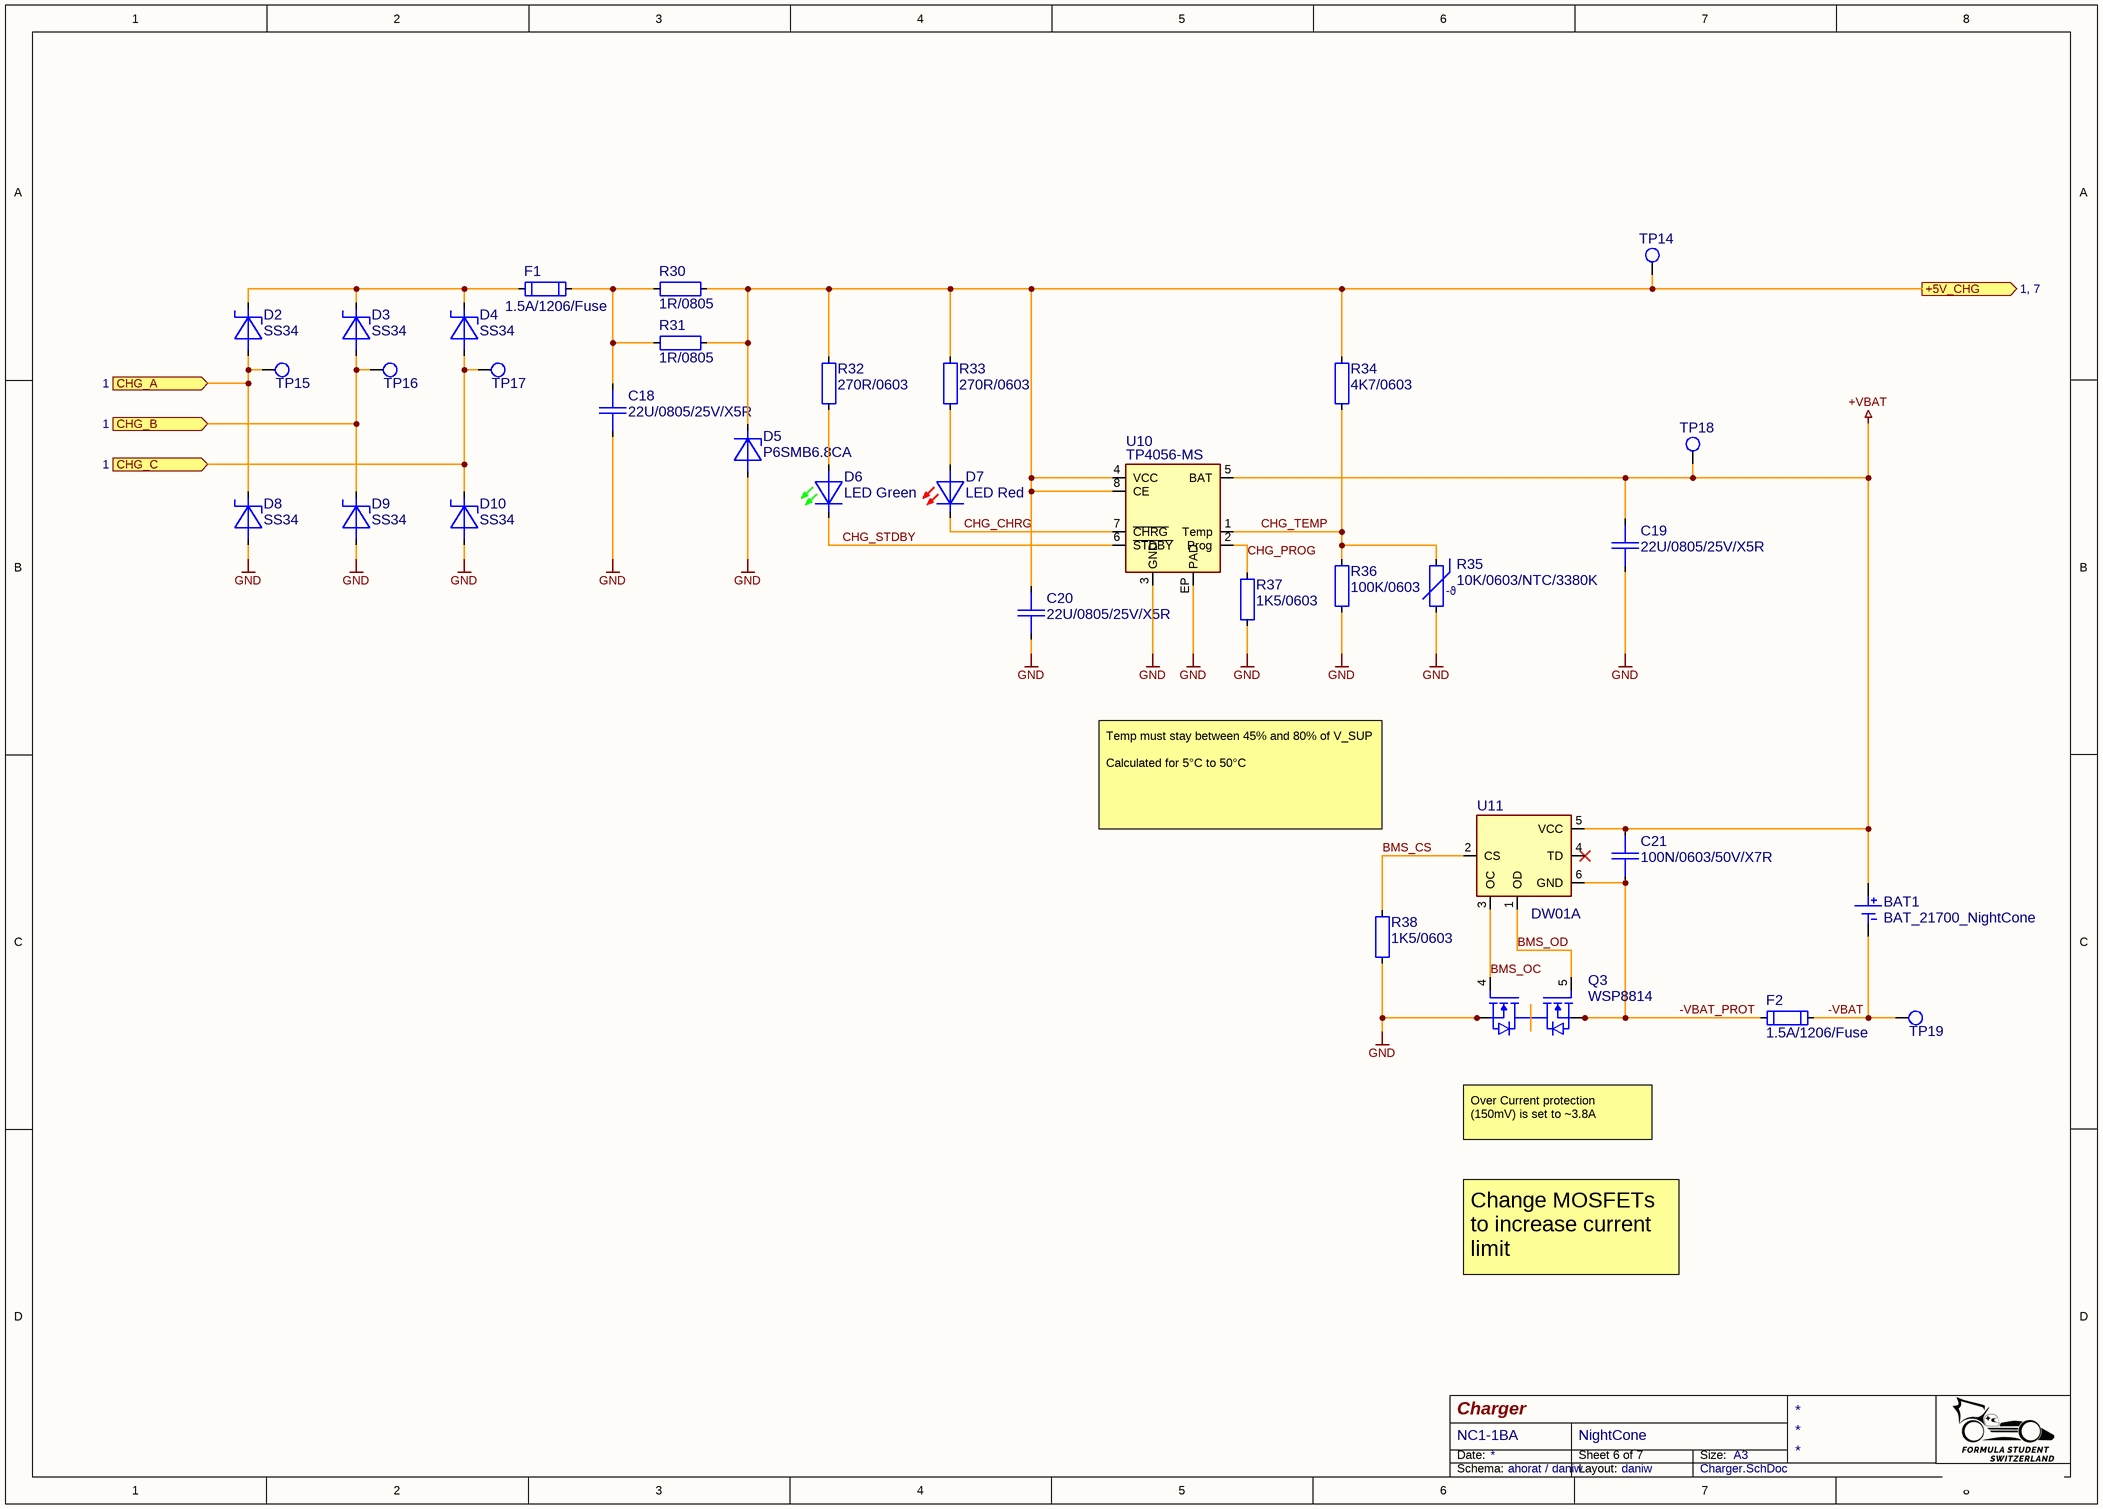
[diagram p5: Charger.SchDoc]

### Parts
BAT1  BAT_21700_NightCone  [BAT-21700-NC]  (no BOM)
C18  22U/0805/25V/X5R  [CAP0805_X7R]
C19  22U/0805/25V/X5R  [CAP0805_X7R]
C20  22U/0805/25V/X5R  [CAP0805_X7R]
C21  100N/0603/50V/X7R  [CAP0603_X7R]
D2  SS34  [DIOM5226X230]
D3  SS34  [DIOM5226X230]
D4  SS34  [DIOM5226X230]
D5  P6SMB6.8CA  [DIOM5436X265]
D6  LED Green  [LED0805_GREEN]
D7  LED Red  [LED0805_RED]
D8  SS34  [DIOM5226X230]
D9  SS34  [DIOM5226X230]
D10  SS34  [DIOM5226X230]
F1  1.5A/1206/Fuse  [Fuse1206-0.55-WW]
F2  1.5A/1206/Fuse  [Fuse1206-0.55-WW]
Q3  WSP8814  [SOP065P650X110-8-NW]
R30  1R/0805  [R0805-0.50-WW]
R31  1R/0805  [R0805-0.50-WW]
R32  270R/0603  [R0603-0.40-WW]
R33  270R/0603  [R0603-0.40-WW]
R34  4K7/0603  [R0603-0.40-WW]
R35  10K/0603/NTC/3380K  [R0603-0.40-WW]
R36  100K/0603  [R0603-0.40-WW]
R37  1K5/0603  [R0603-0.40-WW]
R38  1K5/0603  [R0603-0.40-WW]
TP14  TP_THD_1.5/0.8  [TP_THD_1.5/0.8]  (value not drawn)  (no BOM)
TP15  TP_THD_1.5/0.8  [TP_THD_1.5/0.8]  (value not drawn)  (no BOM)
TP16  TP_THD_1.5/0.8  [TP_THD_1.5/0.8]  (value not drawn)  (no BOM)
TP17  TP_THD_1.5/0.8  [TP_THD_1.5/0.8]  (value not drawn)  (no BOM)
TP18  TP_THD_1.5/0.8  [TP_THD_1.5/0.8]  (value not drawn)  (no BOM)
TP19  TP_THD_1.5/0.8  [TP_THD_1.5/0.8]  (value not drawn)  (no BOM)
U10  TP4056-MS  [SOP127P600X155-9-TH330x240-NW]
U11  DW01A  [SOT2395P280X125-6-SW]

### Ports
+5V_CHG (out, see 1, 7), CHG_A (in, see 1), CHG_B (in, see 1), CHG_C (in, see 1)

### Nets
+VBAT: BAT1.1(+) C19.1 C21.1 TP18.1 U10.5(BAT) U11.5(VCC)
GND: C18.2 C19.2 C20.2 D5.2 D8.2 D9.2 D10.2 Q3.2(S1) Q3.3(S1) R35.2 R36.2 R37.2 R38.2 U10.3(GND) U10.EP(PAD)
+5V_CHG: C20.1 D5.1 R30.2 R31.2 R32.1 R33.1 R34.1 TP14.1 U10.4(VCC) U10.8(CE) ; port +5V_CHG
-VBAT: BAT1.2(-) F2.1 TP19.1
-VBAT_PROT: C21.2 F2.2 Q3.6(S2) Q3.7(S2) U11.6(GND)
BMS_CS: R38.1 U11.2(CS)
BMS_OC: Q3.4(G1) U11.3(OC)
BMS_OD: Q3.5(G2) U11.1(OD)
CHG_A: D2.2 D8.1 TP15.1 ; port CHG_A
CHG_B: D3.2 D9.1 TP16.1 ; port CHG_B
CHG_C: D4.2 D10.1 TP17.1 ; port CHG_C
CHG_CHRG: D7.1 U10.7(~{CHRG})
CHG_PROG: R37.1 U10.2(Prog)
CHG_STDBY: D6.1 U10.6(~{STDBY})
CHG_TEMP: R34.2 R35.1 R36.1 U10.1(Temp)
NetC18_1: C18.1 F1.2 R30.1 R31.1
NetD2_1: D2.1 D3.1 D4.1 F1.1
NetD6_2: D6.2 R32.2
NetD7_2: D7.2 R33.2
NetQ3_1: Q3.1(D) Q3.8(D)

Not connected (* = marked no-connect by the designer): U11 4(TD)*

### Notes on the sheet
- Temp must stay between 45% and 80% of V_SUP
  Calculated for 5°C to 50°C
- Over Current protection  (150mV) is set to ~3.8A
- Change MOSFETs to increase current limit
- Date:
- Size:
- A3
- Schema:
- Layout:
- (in symbol 10K/0603/NTC/3380K) -ϑ

### Library data of the parts
BAT1 = BAT_21700_NightCone: 21700 Battery cell for FSCH nightcone project; Manufacturer: NONE; Part Number: BAT_21700_NightCone
C18-C20 = 22U/0805/25V/X5R: CAP SM 0805 22uF 25V X5R; Manufacturer: GENERIC; Absolute Value: 2.2E-5; Part Number: 22U/0805/25V/X5R; Package: 805; Value: 22uF; Manufacturer Part Number 3: CL21A226MAQNNNE; Supplier 3: LCSC; Supplier Part Number 3: C45783; JLC Type: Basic
C21 = 100N/0603/50V/X7R: CAP SM 0603 100nF 50V X7R; Manufacturer: GENERIC; Manufacturer 1: YAGEO; Manufacturer Part Number 1: CC0603KPX7R9BB104; Absolute Value: 1E-7; Part Number: 100N/0603/50V/X7R; Package: 603; Value: 100nF; HelpURL: https://www.yageo.com/upload/media/product/app/datasheet/mlcc/upy-gphc_x7r_6_3v-to-250v.pdf; Supplier 1: Digi-Key; Supplier Part Number 1: 311-3567-1-ND; Manufacturer 2: YAGEO; Manufacturer Part Number 2: CC0603MRX7R9BB104; Supplier 2: Digi-Key; Supplier Part Number 2: 311-4110-1-ND; Manufacturer Part Number 3: CC0603KRX7R9BB104; Supplier 3: LCSC; Supplier Part Number 3: C14663; JLC Type: Basic
D2-D4 D8-D10 = SS34: Si Shottky Diode 3A DO-214AC; Manufacturer: GENERIC; Part Number: SS34; Package: DO-214AC, SMA; HelpURL: https://datasheet.lcsc.com/lcsc/2303141100_MDD-Microdiode-Electronics--SS34_C8678.pdf; Manufacturer 3: MDD; Manufacturer Part Number 3: SS34; Supplier 3: LCSC; Supplier Part Number 3: C8678; JLC Type: Basic
D5 = P6SMB6.8CA: 10.5V 6.45V 5.8V SMB(DO-214AA) TVS; Manufacturer: Littelfuse Inc.; Absolute Value: 6.8V; Part Number: P6SMB6.8CA; Package: DO-214AA; Value: P6SMB6.8CA; HelpURL: https://datasheet.lcsc.com/lcsc/1810181007_Brightking-P6SMB6-8CA-TR13_C78395.pdf; Manufacturer 3: Brightking; Manufacturer Part Number 3: P6SMB6.8CA/TR13; Supplier 3: LCSC; Supplier Part Number 3: C78395; JLC Type: Basic
D6 = LED Green 0805: Generic LED Green 0805; Manufacturer 1: Würth; Manufacturer Part Number 1: 150080GS75000; Part Number: LED Green 0805; Manufacturer: GENERIC; Package: 805; Value: Green; Absolute Value: Green; HelpURL: https://www.we-online.com/katalog/datasheet/150060VS75000.pdf; Supplier 1: Digi-Key; Supplier Part Number 1: 732-4983-1-ND; Manufacturer 3: Hubei KENTO Elec; Manufacturer Part Number 3: KT-0805G; Supplier 3: LCSC; Supplier Part Number 3: C2297; JLC Type: Basic
D7 = LED Red 0805: Generic LED Red 0805; Manufacturer 1: Würth; Manufacturer Part Number 1: 150080RS75000; Part Number: LED Red 0805; Manufacturer: GENERIC; Package: 805; Value: Red; Absolute Value: Red; HelpURL: https://www.we-online.com/katalog/datasheet/150060RS75000.pdf; Supplier 1: Digi-Key; Supplier Part Number 1: 732-4984-1-ND; Manufacturer 3: Foshan NationStar Optoelectronics; Manufacturer Part Number 3: NCD0805R1; Supplier 3: LCSC; Supplier Part Number 3: C84256; JLC Type: Basic
F1 F2 = 1.5A/1206/Fuse: Multifuse 1206 1.5A; Manufacturer: GENERIC; Manufacturer 1: Bourns; Manufacturer Part Number 1: MF-NSMF150-2; Absolute Value: 1.5; Part Number: 1.5A/1206/Fuse; Package: 1206; Value: 1.5A; HelpURL: https://www.bourns.com/docs/product-datasheets/mf-nsmf.pdf?sfvrsn=39c76af6_20; Supplier 1: Digi-Key; Supplier Part Number 1: MF-NSMF150-2CT-ND; Manufacturer 3: Bourns; Manufacturer Part Number 3: MF-NSMF150-2; Supplier 3: LCSC; Supplier Part Number 3: C89655; JLC Type: Extended
Q3 = WSP8814: 20V 9A 7.6mΩ@4.5V,9A 1.25W 1.2V@250uA 2 N-Channel TSSOP-8; Manufacturer: Winsok Semicon; Part Number: WSP8814; Package: TSSOP-8; HelpURL: https://www.lcsc.com/datasheet/lcsc_datasheet_2211141230_Winsok-Semicon-WSP8814_C148371.pdf; Manufacturer 3: Winsok Semicon; Manufacturer Part Number 3: WSP8814; Supplier 3: LCSC; Supplier Part Number 3: C148371; JLC Type: Extended
R30 R31 = 1R/0805: RES SM 0805 1R; Manufacturer: GENERIC; Manufacturer 1: YAGEO; Manufacturer Part Number 1: RC0805FR-131RL; Absolute Value: 1; Part Number: 1R/0805; Package: 805; Value: 1R; HelpURL: https://www.yageo.com/upload/media/product/productsearch/datasheet/rchip/PYu-RC_Group_51_RoHS_L_12.pdf; Supplier 1: Digi-Key; Supplier Part Number 1: 13-RC0805FR-131RLCT-ND; Manufacturer 2: YAGEO; Manufacturer Part Number 2: RC0805FR-101RL; Supplier 2: Digi-Key; Supplier Part Number 2: 13-RC0805FR-101RLCT-ND; Manufacturer 3: UNI-ROYAL(Uniroyal Elec); Manufacturer Part Number 3: 0805W8F100KT5E; Supplier 3: LCSC; Supplier Part Number 3: C25271; JLC Type: Basic
R32 R33 = 270R/0603: as R24 on sheet FailSafe; Part Number: 270R/0603; Package: 0603; Value: 270R; HelpURL: https://www.yageo.com/upload/media/product/productsearch/datasheet/rchip/PYu-RC_Group_51_RoHS_L_12.pdf; Supplier 1: Digi-Key; Supplier Part Number 1: 13-RC0603FR-13270RLCT-ND; Manufacturer 2: YAGEO; Manufacturer Part Number 2: RC0603FR-10270RL; Supplier 2: Digi-Key; Supplier Part Number 2: 13-RC0603FR-10270RLCT-ND; Manufacturer 3: UNI-ROYAL(Uniroyal Elec); Manufacturer Part Number 3: 0603WAF2700T5E; Supplier 3: LCSC; Supplier Part Number 3: C22966; JLC Type: Basic
R34 = 4K7/0603: RES SM 0603 4K7; Manufacturer: GENERIC; Manufacturer 1: YAGEO; Manufacturer Part Number 1: RC0603FR-134K7L; Absolute Value: 4700; Part Number: 4K7/0603; Package: 0603; Value: 4K7; HelpURL: https://www.yageo.com/upload/media/product/app/datasheet/rchip/pyu-rc_group_51_rohs_l.pdf; Supplier 1: Digi-Key; Supplier Part Number 1: 13-RC0603FR-134K7LCT-ND; Manufacturer 2: YAGEO; Manufacturer Part Number 2: RC0603FR-104K7L; Supplier 2: Digi-Key; Supplier Part Number 2: 13-RC0603FR-104K7LCT-ND; Manufacturer 3: UNI-ROYAL(Uniroyal Elec); Manufacturer Part Number 3: 0603WAF4701T5E; Supplier 3: LCSC; Supplier Part Number 3: C23162; JLC Type: Basic
R35 = 10K/0603/NTC/3380K: as R15 on sheet Control; Part Number: 10K/0603/NTC/3380K; Package: 603; Value: 10K; HelpURL: https://www.murata.com/en-us/api/pdfdownloadapi?cate=luNTCforTempeSenso&partno=NCU18XH103E60RB; Supplier 1: Digi-Key; Supplier Part Number 1: 490-18164-1-ND; Manufacturer 3: Sunlord; Manufacturer Part Number 3: SDNT1608X103F3380FTF; Supplier 3: LCSC; Supplier Part Number 3: C316397; JLC Type: Extended
R36 = 100K/0603: as R19 on sheet FailSafe; Part Number: 100K/0603; Package: 0603; Value: 100K; HelpURL: https://www.yageo.com/upload/media/product/productsearch/datasheet/rchip/PYu-RC_Group_51_RoHS_L_12.pdf; Supplier 1: Digi-Key; Supplier Part Number 1: 13-RC0603FR-13100KLCT-ND; Manufacturer 2: YAGEO; Manufacturer Part Number 2: RC0603FR-10100KL; Supplier 2: Digi-Key; Supplier Part Number 2: 13-RC0603FR-10100KLCT-ND; Manufacturer 3: UNI-ROYAL(Uniroyal Elec); Manufacturer Part Number 3: 0603WAF1003T5E; Supplier 3: LCSC; Supplier Part Number 3: C25803; JLC Type: Basic
R37 R38 = 1K5/0603: as R1 on sheet Control; Part Number: 1K5/0603; Package: 0603; Value: 1K5; HelpURL: https://www.yageo.com/upload/media/product/app/datasheet/rchip/pyu-rc_group_51_rohs_l.pdf; Supplier 1: Digi-Key; Supplier Part Number 1: 13-RC0603FR-131K5LCT-ND; Manufacturer 2: YAGEO; Manufacturer Part Number 2: RC0603FR-101K5L; Supplier 2: Digi-Key; Supplier Part Number 2: 13-RC0603FR-101K5LCT-ND; Manufacturer 3: UNI-ROYAL(Uniroyal Elec); Manufacturer Part Number 3: 0603WAF1501T5E; Supplier 3: LCSC; Supplier Part Number 3: C22843; JLC Type: Basic
TP14-TP19 = TP_THD_1.5/0.8: as TP1 on sheet Control; Part Number: TP_THD_1.5/0.8
U10 = TP4056-MS: 1A Standalone Linear Li-lon Battery Charger with Thermal Regulation in SOP-8; Manufacturer: MSKSEMI; Part Number: TP4056-MS; Package: SOP-8; HelpURL: https://datasheet.lcsc.com/lcsc/2308080947_MSKSEMI-TP4056-MS_C7473158.pdf; Manufacturer 3: MSKSEMI; Manufacturer Part Number 3: TP4056-MS; Supplier 3: LCSC; Supplier Part Number 3: C7473158; JLC Type: Extended
U11 = DW01A: Single Cell Lithium-ion battery protection IC; Manufacturer: PUOLOP; Part Number: DW01A; Package: SOT23-6; HelpURL: https://datasheet.lcsc.com/lcsc/1912111437_PUOLOP-DW01A_C351410.pdf; Manufacturer 3: PUOLOP; Manufacturer Part Number 3: DW01A; Supplier 3: LCSC; Supplier Part Number 3: C351410; JLC Type: Extended